# Altium schematic sheet 2014_FDP_ACTIONNEUR.SchDoc
size A2
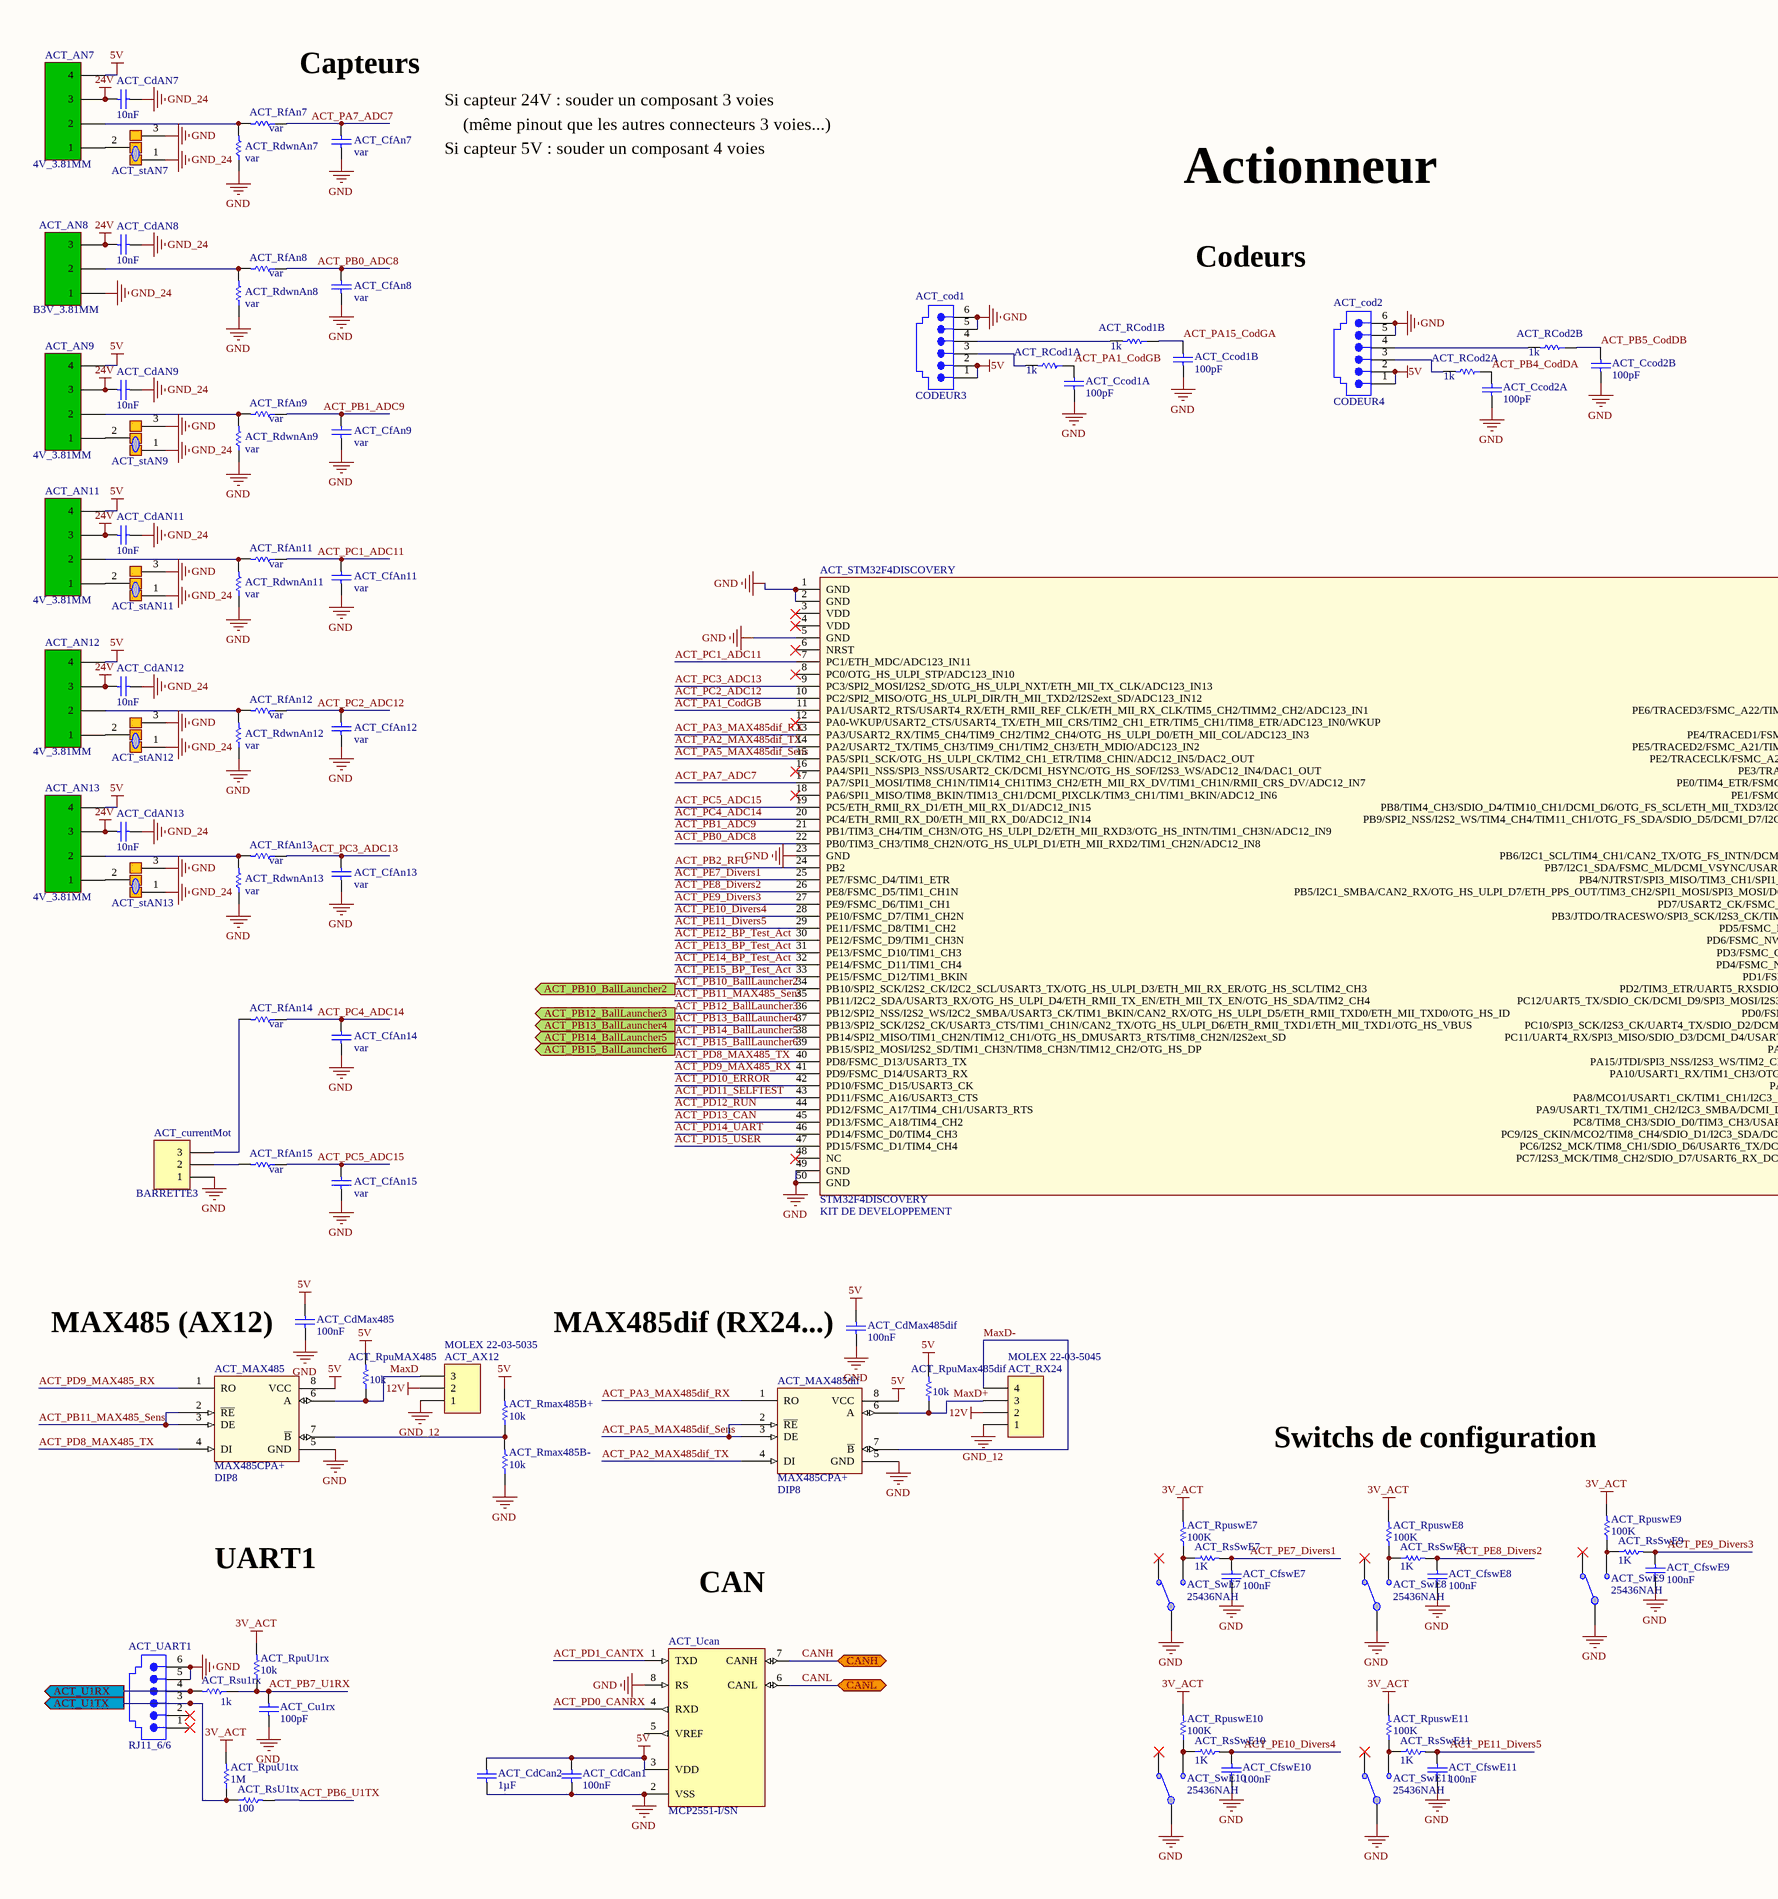
[diagram p0: 2014_FDP_ACTIONNEUR.SchDoc, left]
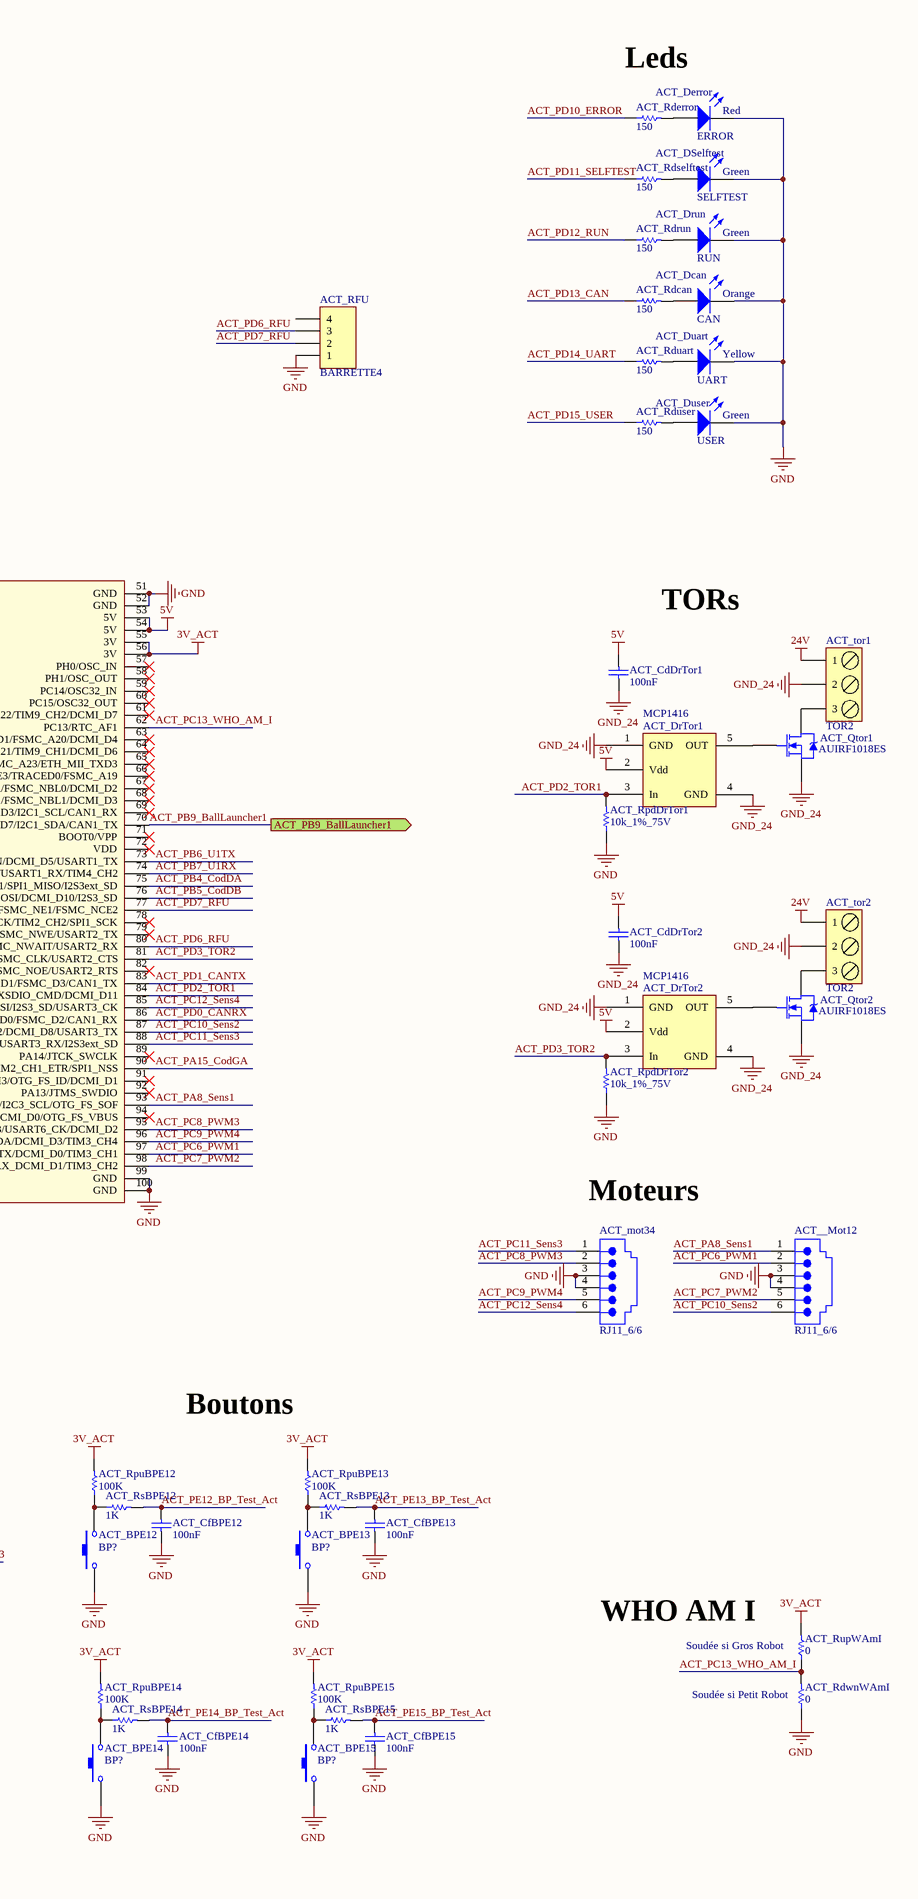
[diagram p1: 2014_FDP_ACTIONNEUR.SchDoc, right]

## Parts
ACT__Mot12  RJ11_6/6  [RJ11_6/6]
ACT_AN7  4V_3.81MM  [BORNIER_4V_3.81MM]
ACT_AN8  B3V_3.81MM  [BORNIER_3V_3.81MM]
ACT_AN9  4V_3.81MM  [BORNIER_4V_3.81MM]
ACT_AN11  4V_3.81MM  [BORNIER_4V_3.81MM]
ACT_AN12  4V_3.81MM  [BORNIER_4V_3.81MM]
ACT_AN13  4V_3.81MM  [BORNIER_4V_3.81MM]
ACT_AX12  MOLEX 22-03-5035  [MOLEX3_2.5MM]
ACT_BPE12  BP?  [Switch 6x6 Vertical]
ACT_BPE13  BP?  [Switch 6x6 Vertical]
ACT_BPE14  BP?  [Switch 6x6 Vertical]
ACT_BPE15  BP?  [Switch 6x6 Vertical]
ACT_Ccod1A  100pF  [C0805_N]
ACT_Ccod1B  100pF  [C0805_N]
ACT_Ccod2A  100pF  [C0805_N]
ACT_Ccod2B  100pF  [C0805_N]
ACT_CdAN7  10nF  [C0805_N]
ACT_CdAN8  10nF  [C0805_N]
ACT_CdAN9  10nF  [C0805_N]
ACT_CdAN11  10nF  [C0805_N]
ACT_CdAN12  10nF  [C0805_N]
ACT_CdAN13  10nF  [C0805_N]
ACT_CdCan1  100nF  [C0805_N]
ACT_CdCan2  1µF  [C0805_N]
ACT_CdDrTor1  100nF  [C0805_N]
ACT_CdDrTor2  100nF  [C0805_N]
ACT_CdMax485  100nF  [C0805_N]
ACT_CdMax485dif  100nF  [C0805_N]
ACT_CfAn7  var  [C0805_N]
ACT_CfAn8  var  [C0805_N]
ACT_CfAn9  var  [C0805_N]
ACT_CfAn11  var  [C0805_N]
ACT_CfAn12  var  [C0805_N]
ACT_CfAn13  var  [C0805_N]
ACT_CfAn14  var  [C0805_N]
ACT_CfAn15  var  [C0805_N]
ACT_CfBPE12  100nF  [C0805_N]
ACT_CfBPE13  100nF  [C0805_N]
ACT_CfBPE14  100nF  [C0805_N]
ACT_CfBPE15  100nF  [C0805_N]
ACT_CfswE7  100nF  [C0805_N]
ACT_CfswE8  100nF  [C0805_N]
ACT_CfswE9  100nF  [C0805_N]
ACT_CfswE10  100nF  [C0805_N]
ACT_CfswE11  100nF  [C0805_N]
ACT_cod1  CODEUR3  [RJ11_6/6 - droit]
ACT_cod2  CODEUR4  [RJ11_6/6 - droit]
ACT_Cu1rx  100pF  [C0805_N]
ACT_currentMot  BARRETTE3  [HE14_3]
ACT_Dcan  CAN  [LED_0805]
ACT_Derror  ERROR  [LED_0805]
ACT_DrTor1  MCP1416  [SOT23-5AN]
ACT_DrTor2  MCP1416  [SOT23-5AN]
ACT_Drun  RUN  [LED_0805]
ACT_DSelftest  SELFTEST  [LED_0805]
ACT_Duart  UART  [LED_0805]
ACT_Duser  USER  [LED_0805]
ACT_MAX485  Type: MAX485CPA+  Package: DIP8  [SO8_N]  (hidden comment: MAX485CPA+_DIP8)
ACT_MAX485dif  Type: MAX485CPA+  Package: DIP8  [SO8_N]  (hidden comment: MAX485CPA+_DIP8)
ACT_mot34  RJ11_6/6  [RJ11_6/6]
ACT_Qtor1  AUIRF1018ES  [D2PAK]
ACT_Qtor2  AUIRF1018ES  [D2PAK]
ACT_RCod1A  1k  [R1206_N]
ACT_RCod1B  1k  [R1206_N]
ACT_RCod2A  1k  [R1206_N]
ACT_RCod2B  1k  [R1206_N]
ACT_Rdcan  150  [R1206_N]
ACT_Rderror  150  [R1206_N]
ACT_Rdrun  150  [R1206_N]
ACT_Rdselftest  150  [R1206_N]
ACT_Rduart  150  [R1206_N]
ACT_Rduser  150  [R1206_N]
ACT_RdwnAn7  var  [R1206_N]
ACT_RdwnAn8  var  [R1206_N]
ACT_RdwnAn9  var  [R1206_N]
ACT_RdwnAn11  var  [R1206_N]
ACT_RdwnAn12  var  [R1206_N]
ACT_RdwnAn13  var  [R1206_N]
ACT_RdwnWAmI  0  [R1206_N]
ACT_RfAn7  var  [R1206_N]
ACT_RfAn8  var  [R1206_N]
ACT_RfAn9  var  [R1206_N]
ACT_RfAn11  var  [R1206_N]
ACT_RfAn12  var  [R1206_N]
ACT_RfAn13  var  [R1206_N]
ACT_RfAn14  var  [R1206_N]
ACT_RfAn15  var  [R1206_N]
ACT_RFU  BARRETTE4  [HE14_4]
ACT_Rmax485B+  10k  [R1206_N]
ACT_Rmax485B-  10k  [R1206_N]
ACT_RpdDrTor1  10k_1%_75V  [R1206_N]
ACT_RpdDrTor2  10k_1%_75V  [R1206_N]
ACT_RpuBPE12  100K  [R1206_N]
ACT_RpuBPE13  100K  [R1206_N]
ACT_RpuBPE14  100K  [R1206_N]
ACT_RpuBPE15  100K  [R1206_N]
ACT_RpuMAX485  10k  [R1206_N]
ACT_RpuMax485dif  10k  [R1206_N]
ACT_RpuswE7  100K  [R1206_N]
ACT_RpuswE8  100K  [R1206_N]
ACT_RpuswE9  100K  [R1206_N]
ACT_RpuswE10  100K  [R1206_N]
ACT_RpuswE11  100K  [R1206_N]
ACT_RpuU1rx  10k  [R1206_N]
ACT_RpuU1tx  1M  [R1206_N]
ACT_RsBPE12  1K  [R1206_N]
ACT_RsBPE13  1K  [R1206_N]
ACT_RsBPE14  1K  [R1206_N]
ACT_RsBPE15  1K  [R1206_N]
ACT_RsSwE7  1K  [R1206_N]
ACT_RsSwE8  1K  [R1206_N]
ACT_RsSwE9  1K  [R1206_N]
ACT_RsSwE10  1K  [R1206_N]
ACT_RsSwE11  1K  [R1206_N]
ACT_Rsu1rx  1k  [R1206_N]
ACT_RsU1tx  100  [R1206_N]
ACT_RupWAmI  0  [R1206_N]
ACT_RX24  MOLEX 22-03-5045  [MOLEX4_2.5MM]
ACT_stAN7  strap  [Goutte Strap_3]  (value not drawn)
ACT_stAN9  strap  [Goutte Strap_3]  (value not drawn)
ACT_stAN11  strap  [Goutte Strap_3]  (value not drawn)
ACT_stAN12  strap  [Goutte Strap_3]  (value not drawn)
ACT_stAN13  strap  [Goutte Strap_3]  (value not drawn)
ACT_STM32F4DISCOVERY  STM32F4DISCOVERY  Type: KIT DE DEVELOPPEMENT  [STM32_F4DISCOVERY]
ACT_SwE7  25436NAH  [SW_UNIPOL_DROIT - APEM 18235]
ACT_SwE8  25436NAH  [SW_UNIPOL_DROIT - APEM 18235]
ACT_SwE9  25436NAH  [SW_UNIPOL_DROIT - APEM 18235]
ACT_SwE10  25436NAH  [SW_UNIPOL_DROIT - APEM 18235]
ACT_SwE11  25436NAH  [SW_UNIPOL_DROIT - APEM 18235]
ACT_tor1  TOR2  [BORNIER3_FEM_COUDE]
ACT_tor2  TOR2  [BORNIER3_FEM_COUDE]
ACT_UART1  RJ11_6/6  [RJ11_6/6]
ACT_Ucan  MCP2551-I/SN  [SO8_N]

## Ports
ACT_PB9_BallLauncher1 (out), ACT_PB10_BallLauncher2 (out), ACT_PB12_BallLauncher3 (out), ACT_PB13_BallLauncher4 (out), ACT_PB14_BallLauncher5 (out), ACT_PB15_BallLauncher6 (out), ACT_U1RX (out), ACT_U1TX (out), CANH (bidir), CANL (bidir)

## Nets
3V_ACT: ACT_RpuBPE12.2 ACT_RpuBPE13.2 ACT_RpuBPE14.2 ACT_RpuBPE15.2 ACT_RpuswE7.2 ACT_RpuswE8.2 ACT_RpuswE9.2 ACT_RpuswE10.2 ACT_RpuswE11.2 ACT_RpuU1rx.2 ACT_RpuU1tx.2 ACT_RupWAmI.2 ACT_STM32F4DISCOVERY.55(3V) ACT_STM32F4DISCOVERY.56(3V)
5V: ACT_AN7.4 ACT_AN9.4 ACT_AN11.4 ACT_AN12.4 ACT_AN13.4 ACT_CdCan1.2 ACT_CdCan2.2 ACT_CdDrTor1.1 ACT_CdDrTor2.1 ACT_CdMax485.2 ACT_CdMax485dif.2 ACT_cod1.1 ACT_cod1.2 ACT_cod2.1 ACT_cod2.2 ACT_DrTor1.2(Vdd) ACT_DrTor2.2(Vdd) ACT_MAX485.8(VCC) ACT_MAX485dif.8(VCC) ACT_Rmax485B+.2 ACT_RpuMAX485.2 ACT_RpuMax485dif.2 ACT_STM32F4DISCOVERY.53(5V) ACT_STM32F4DISCOVERY.54(5V) ACT_Ucan.3(VDD)
12V: ACT_AX12.2 ACT_RX24.2
24V: ACT_AN7.3 ACT_AN8.3 ACT_AN9.3 ACT_AN11.3 ACT_AN12.3 ACT_AN13.3 ACT_CdAN7.2 ACT_CdAN8.2 ACT_CdAN9.2 ACT_CdAN11.2 ACT_CdAN12.2 ACT_CdAN13.2 ACT_tor1.1 ACT_tor2.1
GND: ACT__Mot12.3 ACT__Mot12.4 ACT_BPE12.1 ACT_BPE13.1 ACT_BPE14.1 ACT_BPE15.1 ACT_Ccod1A.1 ACT_Ccod1B.1 ACT_Ccod2A.1 ACT_Ccod2B.1 ACT_CdCan1.1 ACT_CdCan2.1 ACT_CdMax485.1 ACT_CdMax485dif.1 ACT_CfAn7.1 ACT_CfAn8.1 ACT_CfAn9.1 ACT_CfAn11.1 ACT_CfAn12.1 ACT_CfAn13.1 ACT_CfAn14.1 ACT_CfAn15.1 ACT_CfBPE12.1 ACT_CfBPE13.1 ACT_CfBPE14.1 ACT_CfBPE15.1 ACT_CfswE7.1 ACT_CfswE8.1 ACT_CfswE9.1 ACT_CfswE10.1 ACT_CfswE11.1 ACT_cod1.5 ACT_cod1.6 ACT_cod2.5 ACT_cod2.6 ACT_Cu1rx.1 ACT_currentMot.1 ACT_Dcan.2(K) ACT_Derror.2(K) ACT_Drun.2(K) ACT_DSelftest.2(K) ACT_Duart.2(K) ACT_Duser.2(K) ACT_MAX485.5(GND) ACT_MAX485dif.5(GND) ACT_mot34.3 ACT_mot34.4 ACT_RdwnAn7.1 ACT_RdwnAn8.1 ACT_RdwnAn9.1 ACT_RdwnAn11.1 ACT_RdwnAn12.1 ACT_RdwnAn13.1 ACT_RdwnWAmI.1 ACT_RFU.1 ACT_Rmax485B-.1 ACT_RpdDrTor1.1 ACT_RpdDrTor2.1 ACT_stAN7.3 ACT_stAN9.3 ACT_stAN11.3 ACT_stAN12.3 ACT_stAN13.3 ACT_STM32F4DISCOVERY.1(GND) ACT_STM32F4DISCOVERY.2(GND) ACT_STM32F4DISCOVERY.5(GND) ACT_STM32F4DISCOVERY.23(GND) ACT_STM32F4DISCOVERY.49(GND) ACT_STM32F4DISCOVERY.50(GND) ACT_STM32F4DISCOVERY.51(GND) ACT_STM32F4DISCOVERY.52(GND) ACT_STM32F4DISCOVERY.99(GND) ACT_STM32F4DISCOVERY.100(GND) ACT_SwE7.COMMON1 ACT_SwE8.COMMON1 ACT_SwE9.COMMON1 ACT_SwE10.COMMON1 ACT_SwE11.COMMON1 ACT_UART1.5 ACT_UART1.6 ACT_Ucan.2(VSS) ACT_Ucan.8(RS)
GND_12: ACT_AX12.1 ACT_RX24.1
GND_24: ACT_AN8.1 ACT_CdAN7.1 ACT_CdAN8.1 ACT_CdAN9.1 ACT_CdAN11.1 ACT_CdAN12.1 ACT_CdAN13.1 ACT_CdDrTor1.2 ACT_CdDrTor2.2 ACT_DrTor1.1(GND) ACT_DrTor1.4(GND) ACT_DrTor2.1(GND) ACT_DrTor2.4(GND) ACT_Qtor1.3(S) ACT_Qtor2.3(S) ACT_stAN7.1 ACT_stAN9.1 ACT_stAN11.1 ACT_stAN12.1 ACT_stAN13.1 ACT_tor1.2 ACT_tor2.2
ACT_PA1_CodGB: ACT_Ccod1A.2 ACT_RCod1A.1 ACT_STM32F4DISCOVERY.11(PA1/USART2_RTS/USART4_RX/ETH_RMII_REF_CLK/ETH_MII_RX_CLK/TIM5_CH2/TIMM2_CH2/ADC123_IN1)
ACT_PA2_MAX485dif_TX: ACT_MAX485dif.4(DI) ACT_STM32F4DISCOVERY.14(PA2/USART2_TX/TIM5_CH3/TIM9_CH1/TIM2_CH3/ETH_MDIO/ADC123_IN2)
ACT_PA3_MAX485dif_RX: ACT_MAX485dif.1(RO) ACT_STM32F4DISCOVERY.13(PA3/USART2_RX/TIM5_CH4/TIM9_CH2/TIM2_CH4/OTG_HS_ULPI_D0/ETH_MII_COL/ADC123_IN3)
ACT_PA5_MAX485dif_Sens: ACT_MAX485dif.2(~{RE}) ACT_MAX485dif.3(DE) ACT_STM32F4DISCOVERY.15(PA5/SPI1_SCK/OTG_HS_ULPI_CK/TIM2_CH1_ETR/TIM8_CHIN/ADC12_IN5/DAC2_OUT)
ACT_PA7_ADC7: ACT_CfAn7.2 ACT_RfAn7.1 ACT_STM32F4DISCOVERY.17(PA7/SPI1_MOSI/TIM8_CH1N/TIM14_CH1TIM3_CH2/ETH_MII_RX_DV/TIM1_CH1N/RMII_CRS_DV/ADC12_IN7)
ACT_PA8_Sens1: ACT__Mot12.1 ACT_STM32F4DISCOVERY.93(PA8/MCO1/USART1_CK/TIM1_CH1/I2C3_SCL/OTG_FS_SOF)
ACT_PA15_CodGA: ACT_Ccod1B.2 ACT_RCod1B.1 ACT_STM32F4DISCOVERY.90(PA15/JTDI/SPI3_NSS/I2S3_WS/TIM2_CH1_ETR/SPI1_NSS)
ACT_PB0_ADC8: ACT_CfAn8.2 ACT_RfAn8.1 ACT_STM32F4DISCOVERY.22(PB0/TIM3_CH3/TIM8_CH2N/OTG_HS_ULPI_D1/ETH_MII_RXD2/TIM1_CH2N/ADC12_IN8)
ACT_PB1_ADC9: ACT_CfAn9.2 ACT_RfAn9.1 ACT_STM32F4DISCOVERY.21(PB1/TIM3_CH4/TIM_CH3N/OTG_HS_ULPI_D2/ETH_MII_RXD3/OTG_HS_INTN/TIM1_CH3N/ADC12_IN9)
ACT_PB2_RFU: ACT_STM32F4DISCOVERY.24(PB2)
ACT_PB4_CodDA: ACT_Ccod2A.2 ACT_RCod2A.1 ACT_STM32F4DISCOVERY.75(PB4/NJTRST/SPI3_MISO/TIM3_CH1/SPI1_MISO/I2S3ext_SD)
ACT_PB5_CodDB: ACT_Ccod2B.2 ACT_RCod2B.1 ACT_STM32F4DISCOVERY.76(PB5/I2C1_SMBA/CAN2_RX/OTG_HS_ULPI_D7/ETH_PPS_OUT/TIM3_CH2/SPI1_MOSI/SPI3_MOSI/DCMI_D10/I2S3_SD)
ACT_PB6_U1TX: ACT_RsU1tx.2 ACT_STM32F4DISCOVERY.73(PB6/I2C1_SCL/TIM4_CH1/CAN2_TX/OTG_FS_INTN/DCMI_D5/USART1_TX)
ACT_PB7_U1RX: ACT_Cu1rx.2 ACT_RpuU1rx.1 ACT_Rsu1rx.1 ACT_STM32F4DISCOVERY.74(PB7/I2C1_SDA/FSMC_ML/DCMI_VSYNC/USART1_RX/TIM4_CH2)
ACT_PB9_BallLauncher1: ACT_STM32F4DISCOVERY.70(PB9/SPI2_NSS/I2S2_WS/TIM4_CH4/TIM11_CH1/OTG_FS_SDA/SDIO_D5/DCMI_D7/I2C1_SDA/CAN1_TX) ; port ACT_PB9_BallLauncher1
ACT_PB10_BallLauncher2: ACT_STM32F4DISCOVERY.34(PB10/SPI2_SCK/I2S2_CK/I2C2_SCL/USART3_TX/OTG_HS_ULPI_D3/ETH_MII_RX_ER/OTG_HS_SCL/TIM2_CH3) ; port ACT_PB10_BallLauncher2
ACT_PB11_MAX485_Sens: ACT_MAX485.2(~{RE}) ACT_MAX485.3(DE) ACT_STM32F4DISCOVERY.35(PB11/I2C2_SDA/USART3_RX/OTG_HS_ULPI_D4/ETH_RMII_TX_EN/ETH_MII_TX_EN/OTG_HS_SDA/TIM2_CH4)
ACT_PB12_BallLauncher3: ACT_STM32F4DISCOVERY.36(PB12/SPI2_NSS/I2S2_WS/I2C2_SMBA/USART3_CK/TIM1_BKIN/CAN2_RX/OTG_HS_ULPI_D5/ETH_RMII_TXD0/ETH_MII_TXD0/OTG_HS_ID) ; port ACT_PB12_BallLauncher3
ACT_PB13_BallLauncher4: ACT_STM32F4DISCOVERY.37(PB13/SPI2_SCK/I2S2_CK/USART3_CTS/TIM1_CH1N/CAN2_TX/OTG_HS_ULPI_D6/ETH_RMII_TXD1/ETH_MII_TXD1/OTG_HS_VBUS) ; port ACT_PB13_BallLauncher4
ACT_PB14_BallLauncher5: ACT_STM32F4DISCOVERY.38(PB14/SPI2_MISO/TIM1_CH2N/TIM12_CH1/OTG_HS_DMUSART3_RTS/TIM8_CH2N/I2S2ext_SD) ; port ACT_PB14_BallLauncher5
ACT_PB15_BallLauncher6: ACT_STM32F4DISCOVERY.39(PB15/SPI2_MOSI/I2S2_SD/TIM1_CH3N/TIM8_CH3N/TIM12_CH2/OTG_HS_DP) ; port ACT_PB15_BallLauncher6
ACT_PC1_ADC11: ACT_CfAn11.2 ACT_RfAn11.1 ACT_STM32F4DISCOVERY.7(PC1/ETH_MDC/ADC123_IN11)
ACT_PC2_ADC12: ACT_CfAn12.2 ACT_RfAn12.1 ACT_STM32F4DISCOVERY.10(PC2/SPI2_MISO/OTG_HS_ULPI_DIR/TH_MII_TXD2/I2S2ext_SD/ADC123_IN12)
ACT_PC3_ADC13: ACT_CfAn13.2 ACT_RfAn13.1 ACT_STM32F4DISCOVERY.9(PC3/SPI2_MOSI/I2S2_SD/OTG_HS_ULPI_NXT/ETH_MII_TX_CLK/ADC123_IN13)
ACT_PC4_ADC14: ACT_CfAn14.2 ACT_RfAn14.1 ACT_STM32F4DISCOVERY.20(PC4/ETH_RMII_RX_D0/ETH_MII_RX_D0/ADC12_IN14)
ACT_PC5_ADC15: ACT_CfAn15.2 ACT_RfAn15.1 ACT_STM32F4DISCOVERY.19(PC5/ETH_RMII_RX_D1/ETH_MII_RX_D1/ADC12_IN15)
ACT_PC6_PWM1: ACT__Mot12.2 ACT_STM32F4DISCOVERY.97(PC6/I2S2_MCK/TIM8_CH1/SDIO_D6/USART6_TX/DCMI_D0/TIM3_CH1)
ACT_PC7_PWM2: ACT__Mot12.5 ACT_STM32F4DISCOVERY.98(PC7/I2S3_MCK/TIM8_CH2/SDIO_D7/USART6_RX_DCMI_D1/TIM3_CH2)
ACT_PC8_PWM3: ACT_mot34.2 ACT_STM32F4DISCOVERY.95(PC8/TIM8_CH3/SDIO_D0/TIM3_CH3/USART6_CK/DCMI_D2)
ACT_PC9_PWM4: ACT_mot34.5 ACT_STM32F4DISCOVERY.96(PC9/I2S_CKIN/MCO2/TIM8_CH4/SDIO_D1/I2C3_SDA/DCMI_D3/TIM3_CH4)
ACT_PC10_Sens2: ACT__Mot12.6 ACT_STM32F4DISCOVERY.87(PC10/SPI3_SCK/I2S3_CK/UART4_TX/SDIO_D2/DCMI_D8/USART3_TX)
ACT_PC11_Sens3: ACT_mot34.1 ACT_STM32F4DISCOVERY.88(PC11/UART4_RX/SPI3_MISO/SDIO_D3/DCMI_D4/USART3_RX/I2S3ext_SD)
ACT_PC12_Sens4: ACT_mot34.6 ACT_STM32F4DISCOVERY.85(PC12/UART5_TX/SDIO_CK/DCMI_D9/SPI3_MOSI/I2S3_SD/USART3_CK)
ACT_PC13_WHO_AM_I: ACT_RdwnWAmI.2 ACT_RupWAmI.1 ACT_STM32F4DISCOVERY.62(PC13/RTC_AF1)
ACT_PD0_CANRX: ACT_STM32F4DISCOVERY.86(PD0/FSMC_D2/CAN1_RX) ACT_Ucan.4(RXD)
ACT_PD1_CANTX: ACT_STM32F4DISCOVERY.83(PD1/FSMC_D3/CAN1_TX) ACT_Ucan.1(TXD)
ACT_PD2_TOR1: ACT_DrTor1.3(In) ACT_RpdDrTor1.2 ACT_STM32F4DISCOVERY.84(PD2/TIM3_ETR/UART5_RXSDIO_CMD/DCMI_D11)
ACT_PD3_TOR2: ACT_DrTor2.3(In) ACT_RpdDrTor2.2 ACT_STM32F4DISCOVERY.81(PD3/FSMC_CLK/USART2_CTS)
ACT_PD6_RFU: ACT_RFU.3 ACT_STM32F4DISCOVERY.80(PD6/FSMC_NWAIT/USART2_RX)
ACT_PD7_RFU: ACT_RFU.2 ACT_STM32F4DISCOVERY.77(PD7/USART2_CK/FSMC_NE1/FSMC_NCE2)
ACT_PD8_MAX485_TX: ACT_MAX485.4(DI) ACT_STM32F4DISCOVERY.40(PD8/FSMC_D13/USART3_TX)
ACT_PD9_MAX485_RX: ACT_MAX485.1(RO) ACT_STM32F4DISCOVERY.41(PD9/FSMC_D14/USART3_RX)
ACT_PD10_ERROR: ACT_Rderror.1 ACT_STM32F4DISCOVERY.42(PD10/FSMC_D15/USART3_CK)
ACT_PD11_SELFTEST: ACT_Rdselftest.1 ACT_STM32F4DISCOVERY.43(PD11/FSMC_A16/USART3_CTS)
ACT_PD12_RUN: ACT_Rdrun.1 ACT_STM32F4DISCOVERY.44(PD12/FSMC_A17/TIM4_CH1/USART3_RTS)
ACT_PD13_CAN: ACT_Rdcan.1 ACT_STM32F4DISCOVERY.45(PD13/FSMC_A18/TIM4_CH2)
ACT_PD14_UART: ACT_Rduart.1 ACT_STM32F4DISCOVERY.46(PD14/FSMC_D0/TIM4_CH3)
ACT_PD15_USER: ACT_Rduser.1 ACT_STM32F4DISCOVERY.47(PD15/FSMC_D1/TIM4_CH4)
ACT_PE7_Divers1: ACT_CfswE7.2 ACT_RsSwE7.2 ACT_STM32F4DISCOVERY.25(PE7/FSMC_D4/TIM1_ETR)
ACT_PE8_Divers2: ACT_CfswE8.2 ACT_RsSwE8.2 ACT_STM32F4DISCOVERY.26(PE8/FSMC_D5/TIM1_CH1N)
ACT_PE9_Divers3: ACT_CfswE9.2 ACT_RsSwE9.2 ACT_STM32F4DISCOVERY.27(PE9/FSMC_D6/TIM1_CH1)
ACT_PE10_Divers4: ACT_CfswE10.2 ACT_RsSwE10.2 ACT_STM32F4DISCOVERY.28(PE10/FSMC_D7/TIM1_CH2N)
ACT_PE11_Divers5: ACT_CfswE11.2 ACT_RsSwE11.2 ACT_STM32F4DISCOVERY.29(PE11/FSMC_D8/TIM1_CH2)
ACT_PE12_BP_Test_Act: ACT_CfBPE12.2 ACT_RsBPE12.2 ACT_STM32F4DISCOVERY.30(PE12/FSMC_D9/TIM1_CH3N)
ACT_PE13_BP_Test_Act: ACT_CfBPE13.2 ACT_RsBPE13.2 ACT_STM32F4DISCOVERY.31(PE13/FSMC_D10/TIM1_CH3)
ACT_PE14_BP_Test_Act: ACT_CfBPE14.2 ACT_RsBPE14.2 ACT_STM32F4DISCOVERY.32(PE14/FSMC_D11/TIM1_CH4)
ACT_PE15_BP_Test_Act: ACT_CfBPE15.2 ACT_RsBPE15.2 ACT_STM32F4DISCOVERY.33(PE15/FSMC_D12/TIM1_BKIN)
ACT_U1RX: ACT_Rsu1rx.2 ACT_UART1.4 ; port ACT_U1RX
ACT_U1TX: ACT_RpuU1tx.1 ACT_RsU1tx.1 ACT_UART1.3 ; port ACT_U1TX
CANH: ACT_Ucan.7(CANH) ; port CANH
CANL: ACT_Ucan.6(CANL) ; port CANL
MaxD: ACT_AX12.3 ACT_MAX485.6(A) ACT_RpuMAX485.1
MaxD+: ACT_MAX485dif.6(A) ACT_RpuMax485dif.1 ACT_RX24.3
MaxD-: ACT_MAX485dif.7(~{B}) ACT_RX24.4
NetACT_AN7_1: ACT_AN7.1 ACT_stAN7.2
NetACT_AN7_2: ACT_AN7.2 ACT_RdwnAn7.2 ACT_RfAn7.2
NetACT_AN8_2: ACT_AN8.2 ACT_RdwnAn8.2 ACT_RfAn8.2
NetACT_AN9_1: ACT_AN9.1 ACT_stAN9.2
NetACT_AN9_2: ACT_AN9.2 ACT_RdwnAn9.2 ACT_RfAn9.2
NetACT_AN11_1: ACT_AN11.1 ACT_stAN11.2
NetACT_AN11_2: ACT_AN11.2 ACT_RdwnAn11.2 ACT_RfAn11.2
NetACT_AN12_1: ACT_AN12.1 ACT_stAN12.2
NetACT_AN12_2: ACT_AN12.2 ACT_RdwnAn12.2 ACT_RfAn12.2
NetACT_AN13_1: ACT_AN13.1 ACT_stAN13.2
NetACT_AN13_2: ACT_AN13.2 ACT_RdwnAn13.2 ACT_RfAn13.2
NetACT_BPE12_3: ACT_BPE12.3 ACT_RpuBPE12.1 ACT_RsBPE12.1
NetACT_BPE13_3: ACT_BPE13.3 ACT_RpuBPE13.1 ACT_RsBPE13.1
NetACT_BPE14_3: ACT_BPE14.3 ACT_RpuBPE14.1 ACT_RsBPE14.1
NetACT_BPE15_3: ACT_BPE15.3 ACT_RpuBPE15.1 ACT_RsBPE15.1
NetACT_cod1_3: ACT_cod1.3 ACT_RCod1A.2
NetACT_cod1_4: ACT_cod1.4 ACT_RCod1B.2
NetACT_cod2_3: ACT_cod2.3 ACT_RCod2A.2
NetACT_cod2_4: ACT_cod2.4 ACT_RCod2B.2
NetACT_currentMot_2: ACT_currentMot.2 ACT_RfAn15.2
NetACT_currentMot_3: ACT_currentMot.3 ACT_RfAn14.2
NetACT_Dcan_1: ACT_Dcan.1(A) ACT_Rdcan.2
NetACT_Derror_1: ACT_Derror.1(A) ACT_Rderror.2
NetACT_DrTor1_5: ACT_DrTor1.5(OUT) ACT_Qtor1.1(G)
NetACT_DrTor2_5: ACT_DrTor2.5(OUT) ACT_Qtor2.1(G)
NetACT_Drun_1: ACT_Drun.1(A) ACT_Rdrun.2
NetACT_DSelftest_1: ACT_DSelftest.1(A) ACT_Rdselftest.2
NetACT_Duart_1: ACT_Duart.1(A) ACT_Rduart.2
NetACT_Duser_1: ACT_Duser.1(A) ACT_Rduser.2
NetACT_MAX485_7: ACT_MAX485.7(~{B}) ACT_Rmax485B+.1 ACT_Rmax485B-.2
NetACT_Qtor1_2: ACT_Qtor1.2(D) ACT_tor1.3
NetACT_Qtor2_2: ACT_Qtor2.2(D) ACT_tor2.3
NetACT_RpuswE7_1: ACT_RpuswE7.1 ACT_RsSwE7.1 ACT_SwE7.NO1
NetACT_RpuswE8_1: ACT_RpuswE8.1 ACT_RsSwE8.1 ACT_SwE8.NO1
NetACT_RpuswE9_1: ACT_RpuswE9.1 ACT_RsSwE9.1 ACT_SwE9.NO1
NetACT_RpuswE10_1: ACT_RpuswE10.1 ACT_RsSwE10.1 ACT_SwE10.NO1
NetACT_RpuswE11_1: ACT_RpuswE11.1 ACT_RsSwE11.1 ACT_SwE11.NO1

Not connected (* = marked no-connect by the designer): ACT_RFU 4; ACT_STM32F4DISCOVERY 3(VDD)* 4(VDD)* 6(NRST)* 8(PC0/OTG_HS_ULPI_STP/ADC123_IN10)* 12(PA0-WKUP/USART2_CTS/USART4_TX/ETH_MII_CRS/TIM2_CH1_ETR/TIM5_CH1/TIM8_ETR/ADC123_IN0/WKUP)* 16(PA4/SPI1_NSS/SPI3_NSS/USART2_CK/DCMI_HSYNC/OTG_HS_SOF/I2S3_WS/ADC12_IN4/DAC1_OUT)* 18(PA6/SPI1_MISO/TIM8_BKIN/TIM13_CH1/DCMI_PIXCLK/TIM3_CH1/TIM1_BKIN/ADC12_IN6)* 48(NC)* 57(PH0/OSC_IN)* 58(PH1/OSC_OUT)* 59(PC14/OSC32_IN)* 60(PC15/OSC32_OUT)* 61(PE6/TRACED3/FSMC_A22/TIM9_CH2/DCMI_D7)* 63(PE4/TRACED1/FSMC_A20/DCMI_D4)* 64(PE5/TRACED2/FSMC_A21/TIM9_CH1/DCMI_D6)* 65(PE2/TRACECLK/FSMC_A23/ETH_MII_TXD3)* 66(PE3/TRACED0/FSMC_A19)* 67(PE0/TIM4_ETR/FSMC_NBL0/DCMI_D2)* 68(PE1/FSMC_NBL1/DCMI_D3)* 69(PB8/TIM4_CH3/SDIO_D4/TIM10_CH1/DCMI_D6/OTG_FS_SCL/ETH_MII_TXD3/I2C1_SCL/CAN1_RX)* 71(BOOT0/VPP)* 72(VDD)* 78(PB3/JTDO/TRACESWO/SPI3_SCK/I2S3_CK/TIM2_CH2/SPI1_SCK)* 79(PD5/FSMC_NWE/USART2_TX)* 82(PD4/FSMC_NOE/USART2_RTS)* 89(PA14/JTCK_SWCLK)* 91(PA10/USART1_RX/TIM1_CH3/OTG_FS_ID/DCMI_D1)* 92(PA13/JTMS_SWDIO)* 94(PA9/USART1_TX/TIM1_CH2/I2C3_SMBA/DCMI_D0/OTG_FS_VBUS)*; ACT_SwE7 NC1*; ACT_SwE8 NC1*; ACT_SwE9 NC1*; ACT_SwE10 NC1*; ACT_SwE11 NC1*; ACT_UART1 1* 2*; ACT_Ucan 5(VREF)

## Notes on the sheet
- Capteurs
- Si capteur 24V : souder un composant 3 voies
- Leds
- (near ACT_Derror) Red
- Si capteur 5V : souder un composant 4 voies
- (même pinout que les autres connecteurs 3 voies...)
- Actionneur
- (near ACT_DSelftest) Green
- (near ACT_Drun) Green
- Codeurs
- (near ACT_Dcan) Orange
- (near ACT_Duart) Yellow
- (near ACT_Duser) Green
- TORs
- (near ACT_mot34) Moteurs
- MAX485 (AX12)
- (near ACT_CdMax485dif) MAX485dif (RX24...)
- Boutons
- Switchs de configuration
- UART1
- CAN
- WHO AM I
- (near ACT_RupWAmI) Soudée si Gros Robot
- (near ACT_RdwnWAmI) Soudée si Petit Robot
- Title
- Size:
- Date:
- File:
- A2
- Number:
- Time:
- Revision:
- Sheet
- of

## Library data of the parts
ACT__Mot12 ACT_cod1 ACT_cod2 ACT_mot34 ACT_UART1 = RJ11_6/6: Right Angle, Standard Profile, Offset Latch DECconnect, Flangeless PCB Jack; Ports: 1; Positions/Loaded: Port1 - 6 Offset Latch/6; PerformanceCategory: 3; PCB_Mounting: Thru-Hole; DrillSize: Nominal, Rounded to nearest 0.05mm; PCB_Layout: Complies with Manufacturer's Recommendation.; Published: 25-Jun-2002; DatasheetDocument: 18-Dec-2001; PackageDocument: 18-Dec-2001; PackageReference: 15-43-6110; Publisher: Altium Limited; ComponentLink1Description: Manufacturer Link; ComponentLink1URL: http://www.molex.com/; ComponentLink2Description: Datasheet; ComponentLink2URL: http://www.molex.com/cmc_upload/common_files/1212003_41369catalogpage.pdf
  ACT__Mot12 ACT_mot34 ACT_UART1: Type: RJ11_6/6
ACT_AN7 ACT_AN9 ACT_AN11-ACT_AN13 = BORNIER_4V_3.81MM
ACT_AN8 = BORNIER_3V_3.81MM
ACT_AX12 ACT_currentMot = BARRETTE3: Header, 3-Pin; LatestRevisionDate: 17-Jul-2002; LatestRevisionNote: Re-released for DXP Platform.; Publisher: Altium Limited
ACT_BPE12-ACT_BPE15 = SW_Pushbutton_6x6mm_Vertical: Switch tactil 6mm x 6mm Vertical; Published: 27/11/09; PackageReference: 6mm X 6mm; Publisher: Damien Guitton
ACT_Ccod1A ACT_Ccod1B ACT_Ccod2A ACT_Ccod2B ACT_CdAN7-ACT_CdAN9 ACT_CdAN11-ACT_CdAN13 ACT_CdCan1 ACT_CdCan2 ACT_CdMax485 ACT_CdMax485dif ACT_CfAn7-ACT_CfAn9 ACT_CfAn11-ACT_CfAn15 ACT_CfBPE12-ACT_CfBPE15 ACT_CfswE7-ACT_CfswE11 ACT_Cu1rx = Condensateur: Capacitor; Published: 8-Jun-2000; LatestRevisionDate: 17-Jul-2002; LatestRevisionNote: Re-released for DXP Platform.; PackageReference: RAD-0.3; Publisher: Altium Limited
ACT_CdDrTor1 ACT_CdDrTor2 = Capacitor: FAR: 1740614; Published: 8-Jun-2000; LatestRevisionDate: 17-Jul-2002; LatestRevisionNote: Re-released for DXP Platform.; PackageReference: RAD-0.3; Publisher: Altium Limited
ACT_Dcan ACT_Derror ACT_Drun ACT_DSelftest ACT_Duart ACT_Duser = LED: Typical LED; Published: 8-Jun-2000; LatestRevisionDate: 08-Jul-2005; LatestRevisionNote: Mech Layer 1 removed.; PackageReference: LED-1; Publisher: Altium Limited
ACT_DrTor1 ACT_DrTor2 = MCP1402: FAR: 1630421
ACT_MAX485 ACT_MAX485dif = MAX485CPA+_DIP8: EMETTEUR/RECEPTEUR FAIBLE PUISSANCE DE LIAISONS RS422/RS485 - DIP8
ACT_Qtor1 ACT_Qtor2 = IRF1010S: HEXFET N-Channel Power MOSFET; Published: 8-Jun-2000; LatestRevisionDate: 17-Jul-2002; LatestRevisionNote: Re-released for DXP Platform.; DatasheetVersion: PD-9.923; PackageReference: D2PAK; Publisher: Altium Limited; PackageDescription: D2-PAK/TO-263-AB; 3 Leads (1 Cropped); Body 15.5 (inc. leads) x 10.5 mm (LxW max); ComponentLink1Description: Manufacturer Link; ComponentLink1URL: http://www.irf.com/; ComponentLink2Description: Datasheet; ComponentLink2URL: http://www.irf.com/product-info/datasheets/data/irf1010ns.pdf
ACT_RCod1A ACT_RCod1B ACT_RCod2A ACT_RCod2B ACT_Rdcan ACT_Rderror ACT_Rdrun ACT_Rdselftest ACT_Rduart ACT_Rduser ACT_RdwnAn7-ACT_RdwnAn9 ACT_RdwnAn11-ACT_RdwnAn13 ACT_RdwnWAmI ACT_RfAn7-ACT_RfAn9 ACT_RfAn11-ACT_RfAn15 ACT_Rmax485B+ ACT_Rmax485B- ACT_RpuBPE12-ACT_RpuBPE15 ACT_RpuMAX485 ACT_RpuMax485dif ACT_RpuswE7-ACT_RpuswE11 ACT_RpuU1rx ACT_RpuU1tx ACT_RsBPE12-ACT_RsBPE15 ACT_RsSwE7-ACT_RsSwE11 ACT_Rsu1rx ACT_RsU1tx ACT_RupWAmI = Resistor: Published: 8-Jun-2000; LatestRevisionDate: 17-Jul-2002; LatestRevisionNote: Re-released for DXP Platform.; PackageReference: AXIAL-0.5; Publisher: Altium Limited
ACT_RFU ACT_RX24 = BARRETTE4: Header, 4-Pin; LatestRevisionDate: 17-Jul-2002; LatestRevisionNote: Re-released for DXP Platform.; Publisher: Altium Limited
ACT_RpdDrTor1 ACT_RpdDrTor2 = Resistor: FAR: 1469748; Published: 8-Jun-2000; LatestRevisionDate: 17-Jul-2002; LatestRevisionNote: Re-released for DXP Platform.; PackageReference: AXIAL-0.5; Publisher: Altium Limited
ACT_stAN7 ACT_stAN9 ACT_stAN11-ACT_stAN13 = Goutte Strap_3: LatestRevisionDate: 25/11/09; Publisher: Damien Guitton
ACT_STM32F4DISCOVERY = STM32F4DISCOVERY: KIT DE DEVELOPPEMENT POUR MICROCONTROLEUR STM32F407VGT6
ACT_SwE7-ACT_SwE11 = SW SPDT- APEM Série 523x: Switch unipolaire a levier
ACT_tor1 ACT_tor2 = BORNIER3: Terminal blocks, 2 pins, pitch=5mm
ACT_Ucan = MCP2551-I/SN: High-Speed CAN Transceiver, 8-Pin SOIC, Industrial Temperature; Published: 25/11/09; DatasheetVersion: revE, Jan-2007; PackageVersion: revAW, Oct-2008; PackageReference: SOIC-SN8; Publisher: Damien Guitton; PackageDescription: 8-Lead Plastic Small Outline (SN) - Narrow, 3.90mm Body [SOIC]; Code_JEDEC: MS-012; Code_IPC: SOIC127P600-8; ComponentLink1Description: Manufacturer Link; ComponentLink1URL: http://www.microchip.com; ComponentLink2Description: Datasheet; ComponentLink2URL: http://ww1.microchip.com/downloads/en/DeviceDoc/21667E.pdf; ComponentLink3Description: Packaging Specification; ComponentLink3URL: http://ww1.microchip.com/downloads/en/PackagingSpec/00049AW.pdf